# EAGLE design tinyBLE (EAGLE 7.1.0)
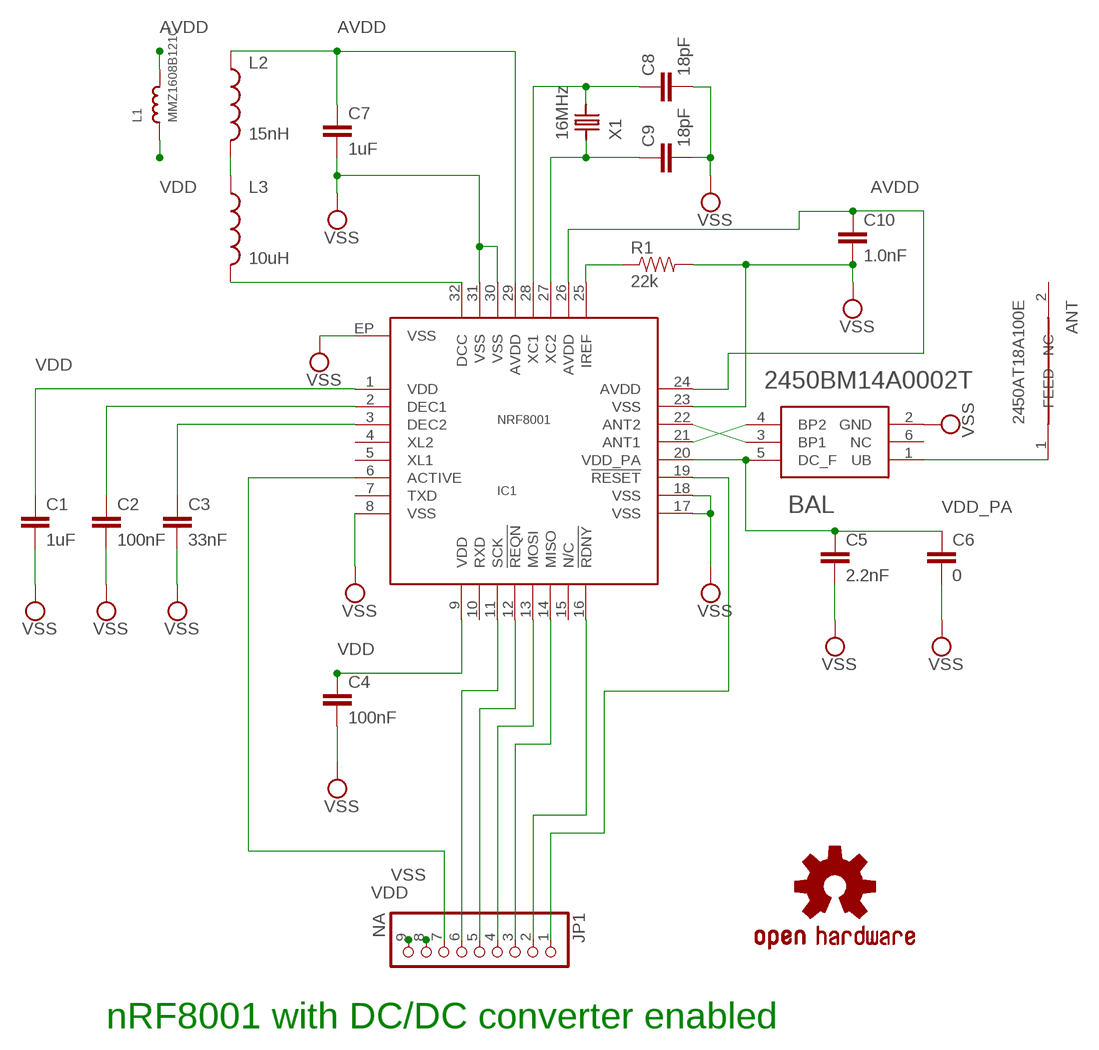
[diagram p0: schematic, sheet 1]

## Parts
ANT  2450AT18A100E  [ANT_0603]
BAL  2450BM14A0002T  [BAL_0603]
C1  1uF  CAP0603-CAP  [0603-CAP]
C2  100nF  CAP0603-CAP  [0603-CAP]
C3  33nF  CAP0603-CAP  [0603-CAP]
C4  100nF  CAP0603-CAP  [0603-CAP]
C5  2.2nF  CAP0603-CAP  [0603-CAP]
C6  0  CAP0603-CAP  [0603-CAP]
C7  1uF  CAP0603-CAP  [0603-CAP]
C8  18pF  CAP0603-CAP  [0603-CAP]
C9  18pF  CAP0603-CAP  [0603-CAP]
C10  1.0nF  CAP0603-CAP  [0603-CAP]
IC1  NRF8001  [QFN-32]
JP1  NA  HEADER-1X9  [1X09_OVAL]
L1  MMZ1608B121C  INDUCTOR0603  [0603]
L2  15nH  INDUCTOR0603  [0603]
L3  10uH  INDUCTOR0603  [0603]
LOGO1  OSHW-LOGOL  [OSHW-LOGO-L]
R1  22k  RESISTOR0603-RES  [0603-RES]
X1  16MHz  CRYSTAL-2.5X3.5  [CRYSTAL-2.5X3.5]

## Nets
AVDD: C7.1 C10.1 IC1.24(AVDD) IC1.26(AVDD) IC1.29(AVDD) L1.2 L2.1
N$3: IC1.11(SCK) JP1.6
N$4: IC1.12(!REQN) JP1.5
N$5: IC1.13(MOSI) JP1.4
N$6: IC1.14(MISO) JP1.3
N$13: L2.2 L3.1
N$14: IC1.32(DCC) L3.2
N$15: ANT.1(FEED) BAL.1(UB)
N$16: C2.1 IC1.2(DEC1)
N$17: C3.1 IC1.3(DEC2)
N$18: BAL.3(BP1) IC1.22(ANT2)
N$19: BAL.4(BP2) IC1.21(ANT1)
N$25: IC1.25(IREF) R1.1
N$26: C9.1 IC1.27(XC2) X1.P$1
N$27: C8.1 IC1.28(XC1) X1.P$3
NRF_ACTV: IC1.6(ACTIVE) JP1.7
NRF_RDNY: IC1.16(!RDNY) JP1.2
NRF_RST: IC1.19(!RESET) JP1.1
VDD: C1.1 C4.1 IC1.1(VDD) IC1.9(VDD) JP1.9 L1.1
VDD_PA: BAL.5(DC_F) C5.1 C6.1 IC1.20(VDD_PA)
VSS: BAL.2(GND) C1.2 C2.2 C3.2 C4.2 C5.2 C6.2 C7.2 C8.2 C9.2 C10.2 IC1.8(VSS) IC1.17(VSS) IC1.18(VSS) IC1.23(VSS) IC1.30(VSS) IC1.31(VSS) IC1.EP(VSS) JP1.8 R1.2
Unconnected: ANT.2(NC) BAL.6(NC) IC1.4(XL2) IC1.5(XL1) IC1.7(TXD) IC1.10(RXD) IC1.15(N/C)

## Notes on the sheet
- nRF8001 with DC/DC converter enabled

## Library data of the parts
ANT = nrf51Lib_edit:2450AT18A100E
BAL = nrf51Lib_edit:2450BM14A0002T
C1-C10 = SparkFun:CAP: Capacitor Standard 0603 ceramic capacitor, and 0.1" leaded capacitor.
IC1 = FitnessDevice:NRF8001: nRF8001 is a Bluetooth® low energy solution designed for operation in the peripheral role. By integrating a Bluetooth low energy compliant radio (PHY), slave mode link controller and host, nRF8001 offers you an easy way to add Bluetooth low energy connectivity to your application.
JP1 = microbuilder:HEADER-1X9: PIN HEADER
L1 = microbuilder:INDUCTOR: Inductors
L2 L3 = SparkFun:INDUCTOR: Inductors
LOGO1 = SparkFun-Aesthetics:OSHW-LOGO: Open Source Hardware Logo This logo indicates the piece of hardware it is found on incorporates a OSHW license and/or adheres to the definition of open source hardware found here: http://freedomdefined.org/OSHW
R1 = SparkFun:RESISTOR: Resistor Basic schematic elements and footprints for 0603, 1206, and PTH resistors.
X1 = FitnessDevice:CRYSTAL-2.5X3.5: ABRACON - ABM8G-16.000MHZ-B4Y-T - Crystal Newark Part Number: 60R3957

## Board
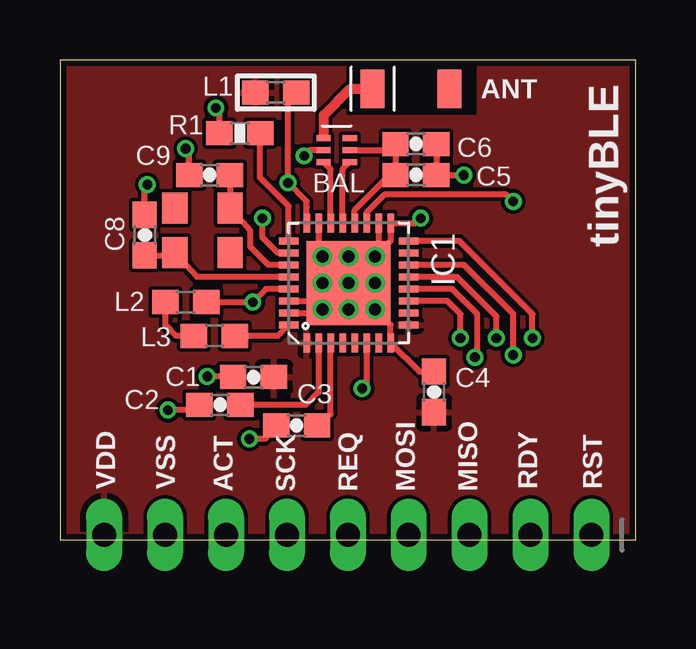
[diagram p1: board, top side]
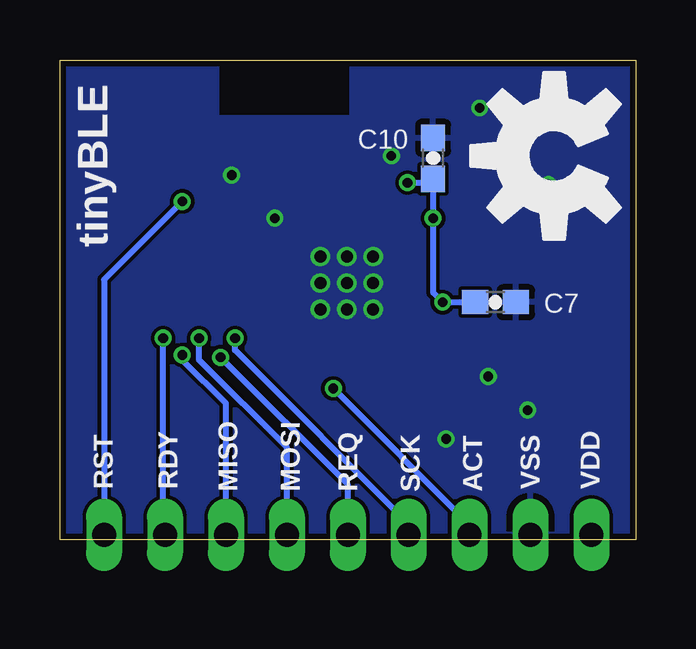
[diagram p2: board, bottom side, seen from below]

Size 24 x 20 mm. Coordinates in mm from the lower left corner, seen from the top.
Outline: 0,0 24,0 24,20 0,20 0,0
Copper layers (1*16): Top 0.035mm / dielectric 1.5mm / Bottom 0.035mm
Design rules "Fusion_eagle_rule_v1.1": minimum track width 6mil, minimum drill 12mil, track to track 6mil, track to pad 6mil, pad to pad 6mil, via to via 6mil, smd to smd 0mil, copper to edge 10mil, drill to drill 10mil, minimum pad ring 10mil, minimum via ring 6mil, stop-mask expansion 2mil, vias tented up to drill 100mil, thermal gap 10mil

### Footprints (pad centres in the part's own frame; a part is rotated, then mirrored left to right if it is on the bottom)
ANT_0603 = smd 1 x 1.6: 1 1.6,0; 2 -1.6,0
BAL_0603 = smd 0.25 x 0.6: 1 0.5,0.55; 2 0,0.55; 3 -0.5,0.55; 4 -0.5,-0.55; 5 0,-0.55; 6 0.5,-0.55
0603-CAP = smd 1.1 x 1: 1 -0.85,0; 2 0.85,0
QFN-32 = smd 0.285 x 0.8: 1 -1.75,-2.5; 2 -1.25,-2.5; 3 -0.75,-2.5; 4 -0.25,-2.5; 5 0.25,-2.5; 6 0.75,-2.5; 7 1.25,-2.5; 8 1.75,-2.5; 17 1.75,2.5; 18 1.25,2.5; 19 0.75,2.5; 20 0.25,2.5; 21 -0.25,2.5; 22 -0.75,2.5; 23 -1.25,2.5; 24 -1.75,2.5 | smd 0.8 x 0.285: 9 2.5,-1.75; 10 2.5,-1.25; 11 2.5,-0.75; 12 2.5,-0.25; 13 2.5,0.25; 14 2.5,0.75; 15 2.5,1.25; 16 2.5,1.75; 25 -2.5,1.75; 26 -2.5,1.25; 27 -2.5,0.75; 28 -2.5,0.25; 29 -2.5,-0.25; 30 -2.5,-0.75; 31 -2.5,-1.25; 32 -2.5,-1.75 | smd 3.5 x 3.5: EP 0,0
1X09_OVAL = drill 1 long: 1 -10.16,0; 2 -7.62,0; 3 -5.08,0; 4 -2.54,0; 5 0,0; 6 2.54,0; 7 5.08,0; 8 7.62,0; 9 10.16,0
0603 = smd 1.1 x 1: 1 -0.85,0; 2 0.85,0
0603-RES = smd 1.1 x 1: 1 -0.85,0; 2 0.85,0
CRYSTAL-2.5X3.5 = smd 1.05 x 1.3: P$1 -1.15,-0.925; P$2 1.15,-0.925; P$3 1.15,0.925; P$4 -1.15,0.925

### Placement (x,y rotation side)
ANT  14.64,18.8 180 top
BAL  11.54,16.24 90 top
C1  8.07,6.78 180 top
C2  6.67,5.62 180 top
C3  9.87,4.76 180 top
C4  15.6,6.16 90 top
C5  14.84,15.2 0 top
C6  14.84,16.5 0 top
C7  5.84,9.9 0 bottom
C8  3.54,12.7 90 top
C9  6.24,15.2 180 top
C10  8.44,15.9 90 bottom
IC1  12.04,10.7 0 top
JP1  12,0.2 180 top
L1  9,18.64 0 top
L2  5.25,9.91 180 top
L3  6.44,8.5 0 top
LOGO1  3.4,16 90 bottom
R1  7.5,16.94 180 top
X1  5.94,12.9 180 top

### Tracks (layer width: path | path; a pad name or v marks a point on that pad's centre or on a via)
AVDD  (via drill 0.4)
  Top 0.254: 8.19,10.05 v8.04,9.9 | v8.04,9.9 L2.1 | v8.44,13.4 8.44,12.6 9.09,11.95 IC1.26 | 10.29,13.85 IC1.24 10.29,14.1 v9.51,14.88 9.51,18.3 L1.2 9.74,18.53 | IC1.29 8.59,10.45 v8.04,9.9
  Bottom 0.254: C7.1 v8.04,9.9 8.44,10.3 v8.44,13.4 C10.1 8.61,14.88 v9.51,14.88
N$3  (via drill 0.4)
  Top 0.254: v16.7,8.4 16.7,9.4 16.15,9.95 IC1.11
  Bottom 0.254: JP1.6 9.46,0.66 16.7,7.9 v16.7,8.4
N$4  (via drill 0.4)
  Top 0.254: v17.3,7.6 17.4,7.7 17.4,9.4 16.35,10.45 IC1.12
  Bottom 0.254: JP1.5 12,2.3 v17.3,7.6
N$5  (via drill 0.4)
  Top 0.254: v18.2,8.4 18.2,9.3 16.55,10.95 IC1.13
  Bottom 0.254: JP1.4 14.54,3.84 18.2,7.5 v18.2,8.4
N$6  (via drill 0.4)
  Top 0.254: v18.9,7.7 18.9,9.4 16.85,11.45 IC1.14
  Bottom 0.254: JP1.3 17.08,5.68 18.9,7.5 v18.9,7.7
N$13
  Top 0.254: L3.1 4.84,8.5 4.4,8.94 L2.2
N$14
  Top 0.254: IC1.32 9.09,8.5 L3.2
N$15
  Top 0.254: BAL.1 11,16.8
  Top 0.305: 11,16.8 11,16.9
  Top 0.406: 11,16.9 11,17.7 12.1,18.8 ANT.1
N$16
  Top 0.254: IC1.2 10.79,6.15 10.26,5.62 C2.1
N$17
  Top 0.254: C3.1 11.29,5.23 IC1.3
N$18
  Top 0.254: IC1.22 11.29,15.44 BAL.3
N$19
  Top 0.254: IC1.21 11.79,15.44 BAL.4
N$25
  Top 0.254: IC1.25 9.54,13.9 8.34,15.1 R1.1
N$26
  Top 0.254: C9.1 X1.P$1 7.94,12.88 7.94,12.2 8.69,11.45 IC1.27
N$27
  Top 0.254: C8.1 4.76,11.85 X1.P$3 5.71,10.95 IC1.28
NRF_ACTV  (via drill 0.4)
  Top 0.254: IC1.6 12.79,6.49 v12.6,6.3
  Bottom 0.254: v12.6,6.3 6.92,0.62 JP1.7
NRF_RDNY  (via drill 0.4)
  Top 0.254: v19.7,8.4 19.7,9.4 16.65,12.45 IC1.16
  Bottom 0.254: JP1.2 19.7,0.28 v19.7,8.4
NRF_RST  (via drill 0.4)
  Top 0.254: IC1.19 12.79,13.64 13.55,14.4 18.6,14.4 v18.9,14.1
  Bottom 0.254: v18.9,14.1 22.16,10.84 JP1.1
VDD
  pour Top: 0,0 0,20 11.8,20 11.8,17.6 17.5,17.6 17.5,20 24,20 24,0
VDD_PA
  Top 0.254: C5.1 C6.1 13.73,16.24 BAL.5 | IC1.20 12.29,13.75 13.74,15.2 C5.1 | 13.64,15.1 C5.1
VSS  (via drill 0.4, 0.5)
  Top 0.254: IC1.31 10.79,9.45 arc90 v10.94,9.6 arc90 10.59,9.95 IC1.30 | v13.14,9.6 13.79,8.95 IC1.8 14.98,7.01 C4.2 | IC1.18 13.29,11.95 v13.14,11.8 13.79,12.45 IC1.17 14.84,13.2 v15.04,13.4 | IC1.23 10.79,11.95 v10.94,11.8 | C8.2 3.54,14.7 v3.64,14.8 | C9.2 5.39,16.15 v5.24,16.3 | C6.2 C5.2 v16.84,15.2 | C1.2 7.2,6.8 v6.14,6.8 | C3.2 8.56,4.2 v7.9,4.2 | C2.2 5.6,5.4 v4.5,5.4 | R1.2 6.65,17.85 v6.5,18 | BAL.2 10.42,16.24 v10.18,16
  other vias: 12.04,10.7 12.04,9.6 13.14,10.7 10.94,10.7 12.04,11.8
  pour Bottom: 0,0 24,0 24,20 17.5,20 17.5,17.6 11.8,17.6 11.8,20 0,20

### Text on the board
tPlace: tinyBLE
bPlace: tinyBLE
tNames: VDD | VSS | ACT | SCK | REQ | MOSI | MISO | RDY | RST
bNames: VDD | VSS | ACT | SCK | REQ | MOSI | MISO | RDY | RST